# Altium schematic sheet dsPIC.SchDoc
size A4; SheetNumber: 2; SheetTotal: 8
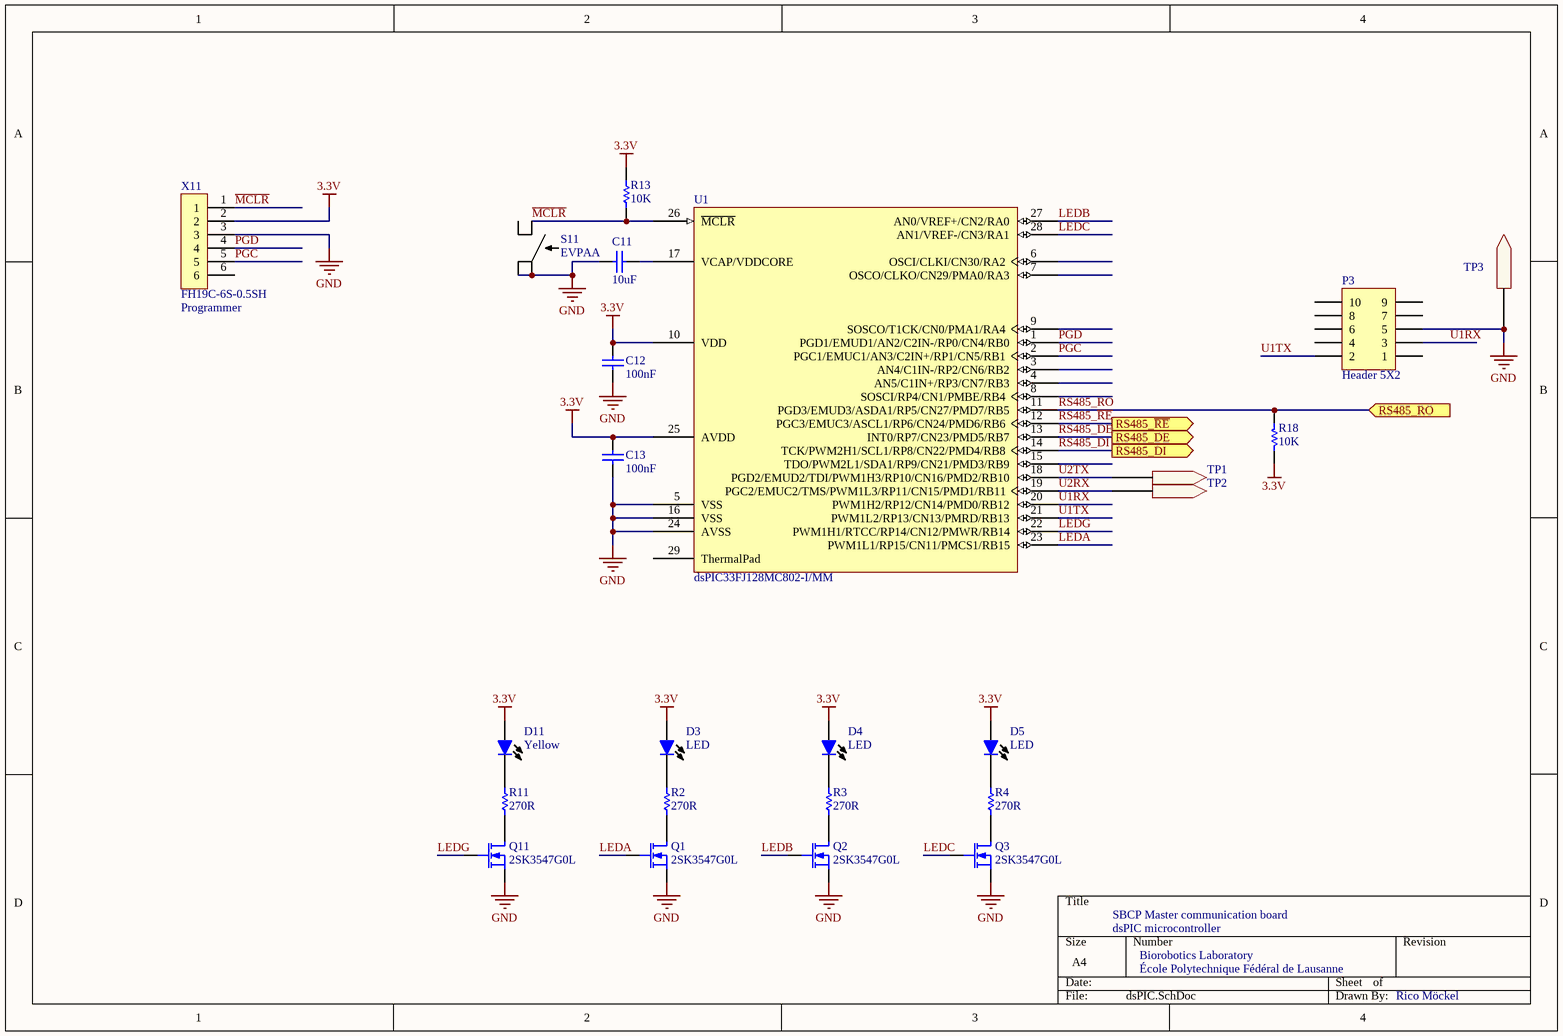
[diagram p0: dsPIC.SchDoc]

## Parts
C11  10uF  [CAPC1608N]
C12  100nF  [CAPC1005N]
C13  100nF  [CAPC1005N]
D3  LED Yellow  [RESC1005N]  (value not drawn)
D4  LED Yellow  [RESC1005N]  (value not drawn)
D5  LED Yellow  [RESC1005N]  (value not drawn)
D11  Color: Yellow  [RESC1005N]  (hidden comment: LED Yellow)
P3  Header 5X2  [HDR2X5]
Q1  2SK3547G0L  [SSS-Mini-3P]
Q2  2SK3547G0L  [SSS-Mini-3P]
Q3  2SK3547G0L  [SSS-Mini-3P]
Q11  2SK3547G0L  [SSS-Mini-3P]
R2  270R  [RESC1005N]
R3  270R  [RESC1005N]
R4  270R  [RESC1005N]
R11  270R  [RESC1005N]
R13  10K  [RESC1005N]
R18  10K  [RESC1005N]
S11  EVPAA  [EVPAA]
TP1  TP  [TPLOGI]  (value not drawn)
TP2  TP  [TPLOGI]  (value not drawn)
TP3  TP  [TPLOGI]  (value not drawn)
U1  dsPIC33FJ128MC802-I/MM  [QFNS-MM28_M_SmallExp]
X11  FH19C-6S-0.5SH  [FH19C-6S-0.5SH]

## Ports
RS485_DE (out), RS485_DI (out), RS485_RO (in), RS485_~{RE} (out)

## Nets
3.3V: C12.1 C13.1 D3.1(A) D4.1(A) D5.1(A) D11.1(A) R13.1 R18.1 U1.10(VDD) U1.25(AVDD) X11.2
GND: C11.1 C12.2 C13.2 P3.5 Q1.S Q2.S Q3.S Q11.S S11.1 S11.4 TP3.1 U1.5(VSS) U1.16(VSS) U1.24(AVSS) X11.3
LEDA: Q1.G U1.23(PWM1L1/RP15/CN11/PMCS1/RB15)
LEDB: Q2.G U1.27(AN0/VREF+/CN2/RA0)
LEDC: Q3.G U1.28(AN1/VREF-/CN3/RA1)
LEDG: Q11.G U1.22(PWM1H1/RTCC/RP14/CN12/PMWR/RB14)
~{MCLR}: R13.2 S11.2 U1.26(~{MCLR}) X11.1
PGC: U1.2(PGC1/EMUC1/AN3/C2IN+/RP1/CN5/RB1) X11.5
PGD: U1.1(PGD1/EMUD1/AN2/C2IN-/RP0/CN4/RB0) X11.4
RS485_DE: U1.13(INT0/RP7/CN23/PMD5/RB7) ; port RS485_DE
RS485_DI: U1.14(TCK/PWM2H1/SCL1/RP8/CN22/PMD4/RB8) ; port RS485_DI
RS485_~{RE}: U1.12(PGC3/EMUC3/ASCL1/RP6/CN24/PMD6/RB6) ; port RS485_~{RE}
RS485_RO: R18.2 U1.11(PGD3/EMUD3/ASDA1/RP5/CN27/PMD7/RB5) ; port RS485_RO
U1RX: P3.3 U1.20(PWM1H2/RP12/CN14/PMD0/RB12)
U1TX: P3.2 U1.21(PWM1L2/RP13/CN13/PMRD/RB13)
U2RX: TP2.1 U1.19(PGC2/EMUC2/TMS/PWM1L3/RP11/CN15/PMD1/RB11)
U2TX: TP1.1 U1.18(PGD2/EMUD2/TDI/PWM1H3/RP10/CN16/PMD2/RB10)
NetC11_2: C11.2 U1.17(VCAP/VDDCORE)
NetD3_2: D3.2(C) R2.1
NetD4_2: D4.2(C) R3.1
NetD5_2: D5.2(C) R4.1
NetD11_2: D11.2(C) R11.1
NetQ1_D: Q1.D R2.2
NetQ2_D: Q2.D R3.2
NetQ3_D: Q3.D R4.2
NetQ11_D: Q11.D R11.2

Not connected (* = marked no-connect by the designer): P3 1 4 6 7 8 9 10; S11 3; U1 3(AN4/C1IN-/RP2/CN6/RB2) 4(AN5/C1IN+/RP3/CN7/RB3) 6(OSCI/CLKI/CN30/RA2) 7(OSCO/CLKO/CN29/PMA0/RA3) 8(SOSCI/RP4/CN1/PMBE/RB4) 9(SOSCO/T1CK/CN0/PMA1/RA4) 15(TDO/PWM2L1/SDA1/RP9/CN21/PMD3/RB9) 29(ThermalPad); X11 6

## Notes on the sheet
- (near X11) Programmer
- SBCP Master communication board
- dsPIC microcontroller
- École Polytechnique Fédéral de Lausanne
- Biorobotics Laboratory
- Rico Möckel

## Library data of the parts
C11-C13 = Cap: Capacitor; Published: 8-Jun-2000; LatestRevisionDate: 17-Jul-2002; LatestRevisionNote: Re-released for DXP Platform.; PackageReference: 0603; Publisher: Altium Limited
  C11: Value: 10uF
  C12 C13: Value: 100nF
D3-D5 D11 = LED
  D3-D5: Color: LED
P3 = Header 5X2: Header, 5-Pin, Dual row; LatestRevisionDate: 17-Jul-2002; LatestRevisionNote: Re-released for DXP Platform.; Publisher: Altium Limited
Q1-Q3 Q11 = nFET: N-Channel MOSFET 100mA, 50V, 12R; pin to pad: D>3 G>1 S>2
R2-R4 R11 R13 R18 = Res1: Resistor; Published: 8-Jun-2000; LatestRevisionDate: 17-Jul-2002; LatestRevisionNote: Re-released for DXP Platform.; PackageReference: AXIAL-0.3; Publisher: Altium Limited
  R2-R4 R11: Value: 270R
  R13: Value: 10K
S11 = Push button
TP1-TP3 = TP: Test Point
U1 = dsPIC33FJ128MC802-I/MM: High-Performance 16-bit Digital Signal Controller, 128 KB Flash, 16 KB RAM, 28-Pin QFN, Industrial Temperature; Published: 29-Jan-2009; DatasheetVersion: revB, Mar-2008; PackageVersion: revAW, Oct-2008; PackageReference: QFNS-MM28; Publisher: Altium Limited; PackageDescription: 28-Lead Plastic Quad Flat, No Lead Package (MM) - 6x6x0.9 mm Body [QFN-S] with 0.40 mm Contact Length; ComponentLink1Description: Manufacturer Link; ComponentLink1URL: http://www.microchip.com; ComponentLink2Description: Datasheet; ComponentLink2URL: http://ww1.microchip.com/downloads/en/DeviceDoc/70291B.pdf; ComponentLink3Description: Packaging Specification; ComponentLink3URL: http://ww1.microchip.com/downloads/en/PackagingSpec/00049AW.pdf
X11 = FH19C-6: Board to flexible PCB/wire connector